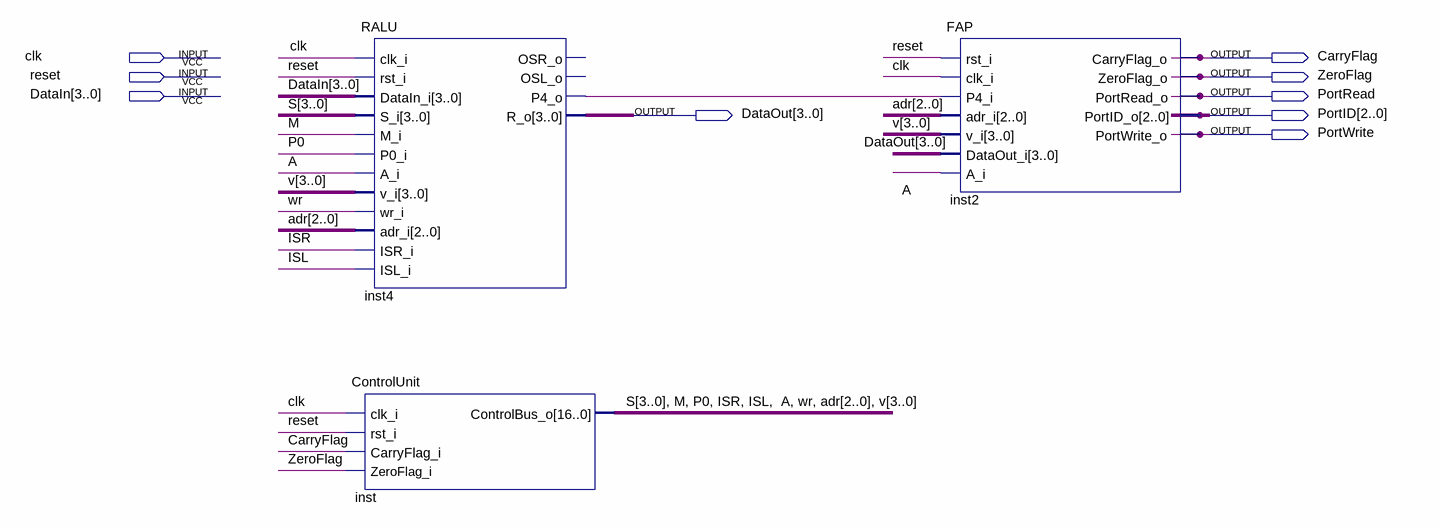
[diagram p0: schematic sheet]
// Quartus schematic MCD.bdf as structural Verilog: 3 symbols, 9 pins
module MCD (
  input  clk,
  input  reset,
  input  [3:0] DataIn,
  output CarryFlag,
  output ZeroFlag,
  output PortRead,
  output [3:0] DataOut,
  output [2:0] PortID,
  output PortWrite
);

  wire A, inst4_p4_o, ISL, ISR, M, P0, wr;
  wire [2:0] adr;
  wire [3:0] S, v;

  RALU inst4 (
    .clk_i(clk), .rst_i(reset), .DataIn_i(DataIn), .S_i(S), .M_i(M), .P0_i(P0), .A_i(A), .v_i(v), .wr_i(wr),
    .adr_i(adr), .ISR_i(ISR), .ISL_i(ISL), .P4_o(inst4_p4_o), .R_o(DataOut));  // open: OSR_o, OSL_o
  ControlUnit inst (
    .clk_i(clk), .rst_i(reset), .CarryFlag_i(CarryFlag), .ZeroFlag_i(ZeroFlag),
    .ControlBus_o({S, M, P0, ISR, ISL, A, wr, adr, v}));
  FAP inst2 (
    .rst_i(reset), .clk_i(clk), .P4_i(inst4_p4_o), .adr_i(adr), .v_i(v), .DataOut_i(DataOut), .A_i(A),
    .CarryFlag_o(CarryFlag), .ZeroFlag_o(ZeroFlag), .PortRead_o(PortRead), .PortID_o(PortID),
    .PortWrite_o(PortWrite));
endmodule
